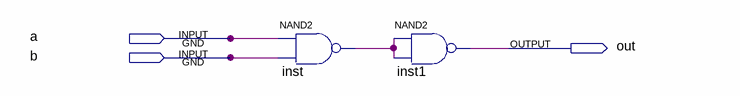
[diagram p0: schematic sheet]
// Quartus schematic And-primitive.bdf as structural Verilog: 2 symbols, 3 pins
module \And-primitive  (
  input  a,
  input  b,
  output out
);

  wire inst_out;

  nand inst (inst_out, a, b);
  nand inst1 (out, inst_out, inst_out);
endmodule
